# Altium schematic sheet RX_LNA.SchDoc
size B; SheetNumber: 5; SheetTotal: 14
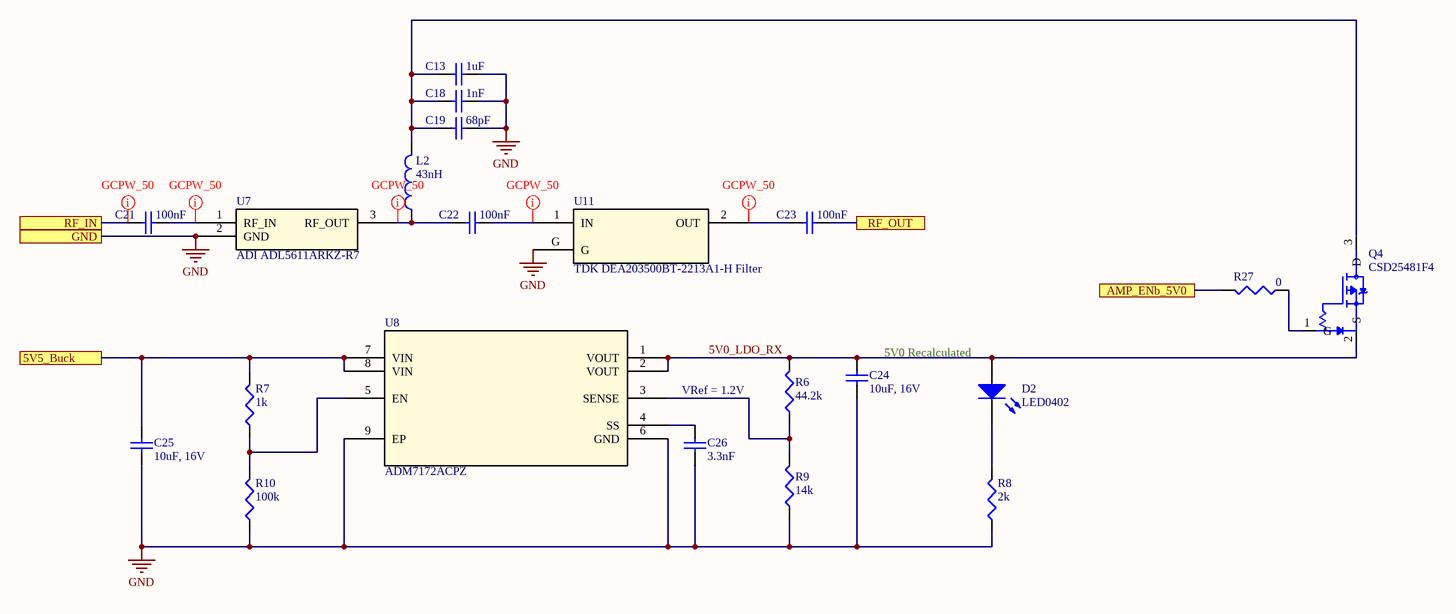
[diagram p0: RX_LNA.SchDoc]

## Parts
C13  1uF  [SMD-0402]
C18  1nF  [SMD-0402]
C19  68pF  [SMD-0402]
C21  100nF  [SMD-0402]
C22  100nF  [SMD-0402]
C23  100nF  [SMD-0402]
C24  10uF, 16V  [SMD-0603]
C25  10uF, 16V  [SMD-0603]
C26  3.3nF  [Johanson-0201]
D2  LED0402  [LED-0402]
L2  43nH  [SMD-0603]
Q4  CSD25481F4  [CSD25481F4]
R6  44.2k  [SMD-0402]
R7  1k  [SMD-0402]
R8  2k  [SMD-0402]
R9  14k  [SMD-0402]
R10  100k  [SMD-0402]
R27  0  [SMD-0402]
U7  ADI ADL5611ARKZ-R7  [Analog Devices ADL5545ARKZ]
U8  ADM7172ACPZ  [ADM7172_VIA_NOSILK]
U11  TDK DEA203500BT-2213A1-H Filter  [TDK DEA203500BT-2213A1-H Bandpass Filter]

## Ports
5V5_Buck, AMP_ENb_5V0, GND, RF_IN, RF_OUT

## Nets
GND: C13.1 C18.1 C19.1 C24.1 C25.1 C26.1 R8.1 R9.1 R10.1 U7.2(GND) U8.6(GND) U8.9(EP) U11.G ; port GND
5V0_LDO_RX: C24.2 D2.2(A) Q4.2(S) R6.2 U8.1(VOUT) U8.2(VOUT)
5V5_Buck: C25.2 R7.2 U8.7(VIN) U8.8(VIN) ; port 5V5_Buck
AMP_ENb_5V0: R27.2 ; port AMP_ENb_5V0
RF_IN: C21.2 ; port RF_IN
RF_OUT: C23.1 ; port RF_OUT
NetC13_2: C13.2 C18.2 C19.2 L2.2 Q4.3(D)
NetC21_1: C21.1 U7.1(RF_IN)
NetC22_1: C22.1 U11.1(IN)
NetC22_2: C22.2 L2.1 U7.3(RF_OUT)
NetC23_2: C23.2 U11.2(OUT)
NetC26_2: C26.2 U8.4(SS)
NetD2_1: D2.1(K) R8.2
NetQ4_1: Q4.1(G) R27.1
NetR6_1: R6.1 R9.2 U8.3(SENSE)
NetR7_1: R7.1 R10.2 U8.5(EN)

## Layout directives
net class GCPW_50: NetC21_1, NetC22_1, NetC22_2, NetC23_2, RF_IN

## Notes on the sheet
- 5V0 Recalculated
- VRef = 1.2V

## Library data of the parts
C13 C18 C19 C21-C23 = CAP0402: Ceramic Capacitor 0402
C24 C25 = CAP0603: Ceramic Capacitor 0603
C26 = CAP0201: Capacitor 0201 Imperial
D2 = LED0402: LED 0402
L2 = L0603: Inductor 0603
Q4 = CSD25481F4: -20V, P ch NexFET MOSFET, single LGA 0.6x1.0, 105mOhm 3-PICOSTAR -55 to 150; MF: Texas Instruments; MP: CSD25481F4; Purchase-URL: https://pricing.snapeda.com/search/part/CSD25481F4/?ref=eda; Price: None; SnapEDA_Link: https://www.snapeda.com/parts/CSD25481F4/Texas%20Instruments/view-part/808987/?ref=snap; Check_prices: https://www.snapeda.com/parts/CSD25481F4/Texas%20Instruments/view-part/808987/?ref=eda; Package: PICOSTAR-3 Texas Instruments; Availability: Good; Value: *
R6-R10 R27 = RES0402: Resistor-0402
U7 = ADI ADL5611ARKZ-R7: IC AMP W-CDMA 30MHZ-6GHZ SOT89-3; Mfr_Name: Analog Devices Inc; RefDes: RefDes; Type: Type
U8 = ADM7172ACPZ: 6.5V, 2A, Ultralow Noise, High PSRR, Fast Transient Response CMOS LDO; Value: Value; Type: Type; RefDes: RefDes
U11 = TDK DEA203500BT-2213A1-H Filter: 3.5 GHz Center Freq BPF; Mfr_Name: TDK; RefDes: RefDes; Type: Type